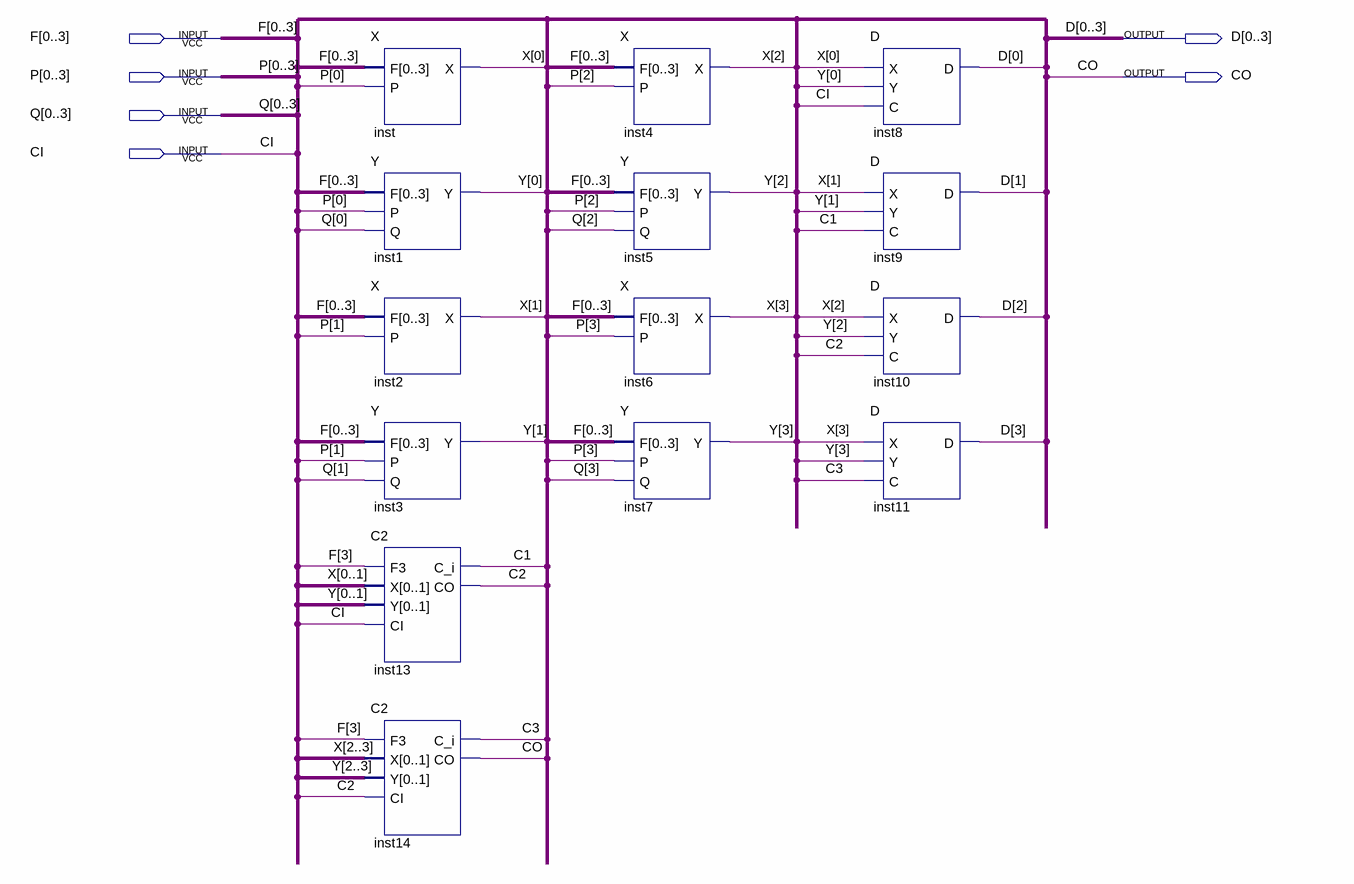
[diagram p0: schematic sheet]
// Quartus schematic LSM4.bdf as structural Verilog: 14 symbols, 6 pins
module LSM4 (
  input  [0:3] F,
  input  [0:3] P,
  input  [0:3] Q,
  input  CI,
  output [0:3] D,
  output CO
);

  wire C1, C2, C3;
  wire [3:0] X, Y;

  X inst (.F(F), .P(P[0]), .X(X[0]));
  Y inst1 (.F(F), .P(P[0]), .Q(Q[0]), .Y(Y[0]));
  X inst2 (.F(F), .P(P[1]), .X(X[1]));
  Y inst3 (.F(F), .P(P[1]), .Q(Q[1]), .Y(Y[1]));
  C2 inst13 (.F3(F[3]), .X({X[0], X[1]}), .Y({Y[0], Y[1]}), .CI(CI), .C_i(C1), .CO(C2));
  C2 inst14 (.F3(F[3]), .X({X[2], X[3]}), .Y({Y[2], Y[3]}), .CI(C2), .C_i(C3), .CO(CO));
  X inst4 (.F(F), .P(P[2]), .X(X[2]));
  Y inst5 (.F(F), .P(P[2]), .Q(Q[2]), .Y(Y[2]));
  X inst6 (.F(F), .P(P[3]), .X(X[3]));
  Y inst7 (.F(F), .P(P[3]), .Q(Q[3]), .Y(Y[3]));
  D inst8 (.X(X[0]), .Y(Y[0]), .C(CI), .D(D[0]));
  D inst9 (.X(X[1]), .Y(Y[1]), .C(C1), .D(D[1]));
  D inst10 (.X(X[2]), .Y(Y[2]), .C(C2), .D(D[2]));
  D inst11 (.X(X[3]), .Y(Y[3]), .C(C3), .D(D[3]));
endmodule
